# Altium schematic sheet M_Audio.SchDoc
size Letter
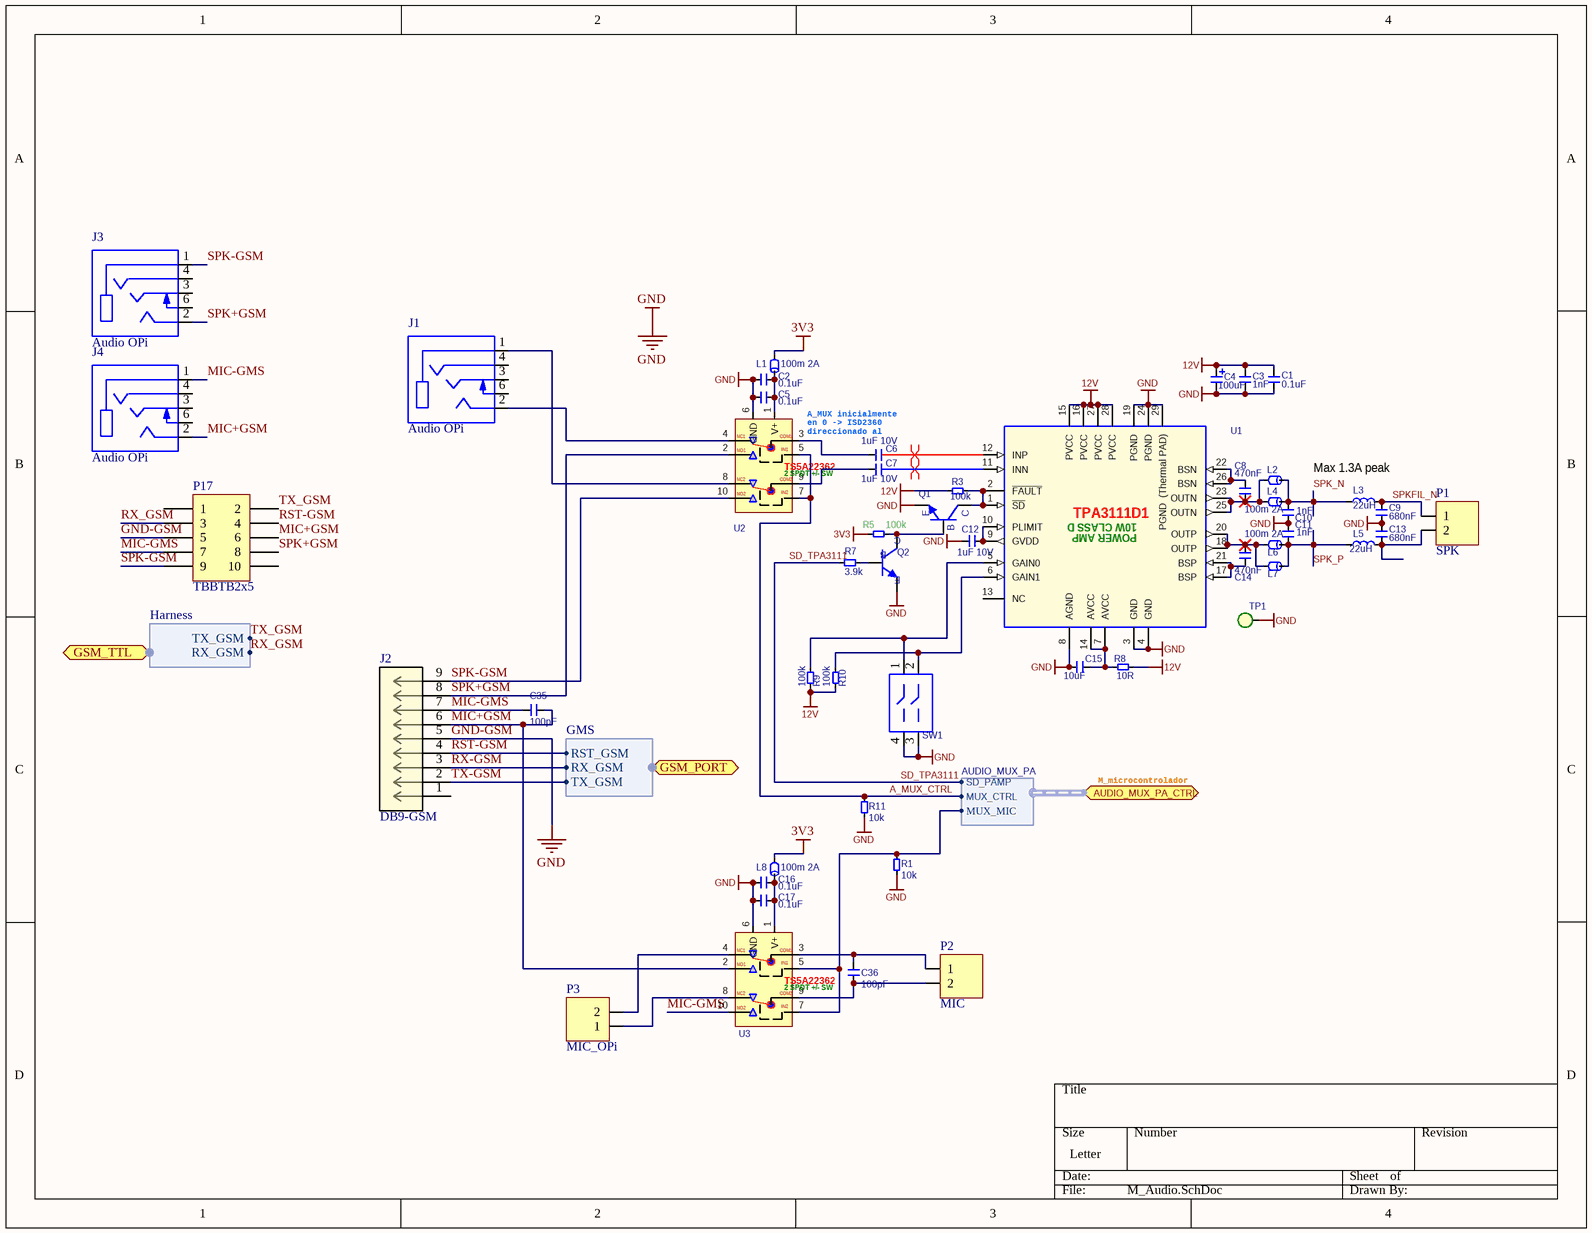
[diagram p0: M_Audio.SchDoc]

## Parts
C1  value 0.1uF  [PASS_CAPC0603 - REFLOW]  (hidden comment: PASS_CAP_EIL)
C2  value 0.1uF  [PASS_CAPC0603 - REFLOW]  (hidden comment: PASS_CAP_EIL)
C3  value 1nF  [PASS_CAPC0603 - REFLOW]  (hidden comment: PASS_CAP_EIL)
C4  value 100uF  [PASS_CAPPOL_SMD-F]  (hidden comment: PASS_CAPPOL_EIL)
C5  value 0.1uF  [PASS_CAPC0603 - REFLOW]  (hidden comment: PASS_CAP_EIL)
C6  value 1uF 10V  [PASS_CAPC0603 - REFLOW]  (hidden comment: PASS_CAP_EIL)
C7  value 1uF 10V  [PASS_CAPC0603 - REFLOW]  (hidden comment: PASS_CAP_EIL)
C8  value 470nF  [PASS_CAPC0603 - REFLOW]  (hidden comment: PASS_CAP_EIL)
C9  value 680nF  [PASS_CAPC1206 - REFLOW]  (hidden comment: PASS_CAP_EIL)
C10  value 1nF  [PASS_CAPC0603 - REFLOW]  (hidden comment: PASS_CAP_EIL)
C11  value 1nF  [PASS_CAPC0603 - REFLOW]  (hidden comment: PASS_CAP_EIL)
C12  value 1uF 10V  [PASS_CAPC0603 - REFLOW]  (hidden comment: PASS_CAP_EIL)
C13  value 680nF  [PASS_CAPC1206 - REFLOW]  (hidden comment: PASS_CAP_EIL)
C14  value 470nF  [PASS_CAPC0603 - REFLOW]  (hidden comment: PASS_CAP_EIL)
C15  value 10uF  [PASS_CAPC0805 - REFLOW]  (hidden comment: PASS_CAP_EIL)
C16  value 0.1uF  [PASS_CAPC0603 - REFLOW]  (hidden comment: PASS_CAP_EIL)
C17  value 0.1uF  [PASS_CAPC0603 - REFLOW]  (hidden comment: PASS_CAP_EIL)
C35  value 100pF  [PASS_CAPC0603 - REFLOW]  (hidden comment: PASS_CAP_EIL)
C36  value 100pF  [PASS_CAPC0603 - REFLOW]  (hidden comment: PASS_CAP_EIL)
J1  Audio OPi  [CUI_SJ-43515RS-SMT]
J2  DB9-GSM  [CONN_5747844-6]
J3  Audio OPi  [CUI_SJ-43515RS-SMT]
J4  Audio OPi  [CUI_SJ-43515RS-SMT]
L1  value 100m 2A  [PASS_FER0805 - REFLOW]  (hidden comment: PASS_FERRITEBEAD_EIL)
L2  PASS_FERRITEBEAD_EIL  [PASS_FER1812 - REFLOW]  (value not drawn)
L3  value 22uH  [PASS_INDUCT_BOURNS_SRU1063]  (hidden comment: PASS_L_EIL)
L4  value 100m 2A  [PASS_FER0805 - REFLOW]  (hidden comment: PASS_FERRITEBEAD_EIL)
L5  value 22uH  [PASS_INDUCT_BOURNS_SRU1063]  (hidden comment: PASS_L_EIL)
L6  value 100m 2A  [PASS_FER0805 - REFLOW]  (hidden comment: PASS_FERRITEBEAD_EIL)
L7  PASS_FERRITEBEAD_EIL  [PASS_FER1812 - REFLOW]  (value not drawn)
L8  value 100m 2A  [PASS_FER0805 - REFLOW]  (hidden comment: PASS_FERRITEBEAD_EIL)
P1  SPK  [TBHDR2P3.5VERTICAL]
P2  MIC  [TBHDR2P3.5VERTICAL]
P3  MIC_OPi  [TBHDR2P3.5VERTICAL]
P17  TBBTB2x5  [TBBTB2x5]
Q1  TRAN_BJT_NPN_EIL  [3PIN_SOT-23 BJT - REFLOW]  (value not drawn)
Q2  TRAN_BJT_NPN_EIL  [3PIN_SOT-23 BJT - REFLOW]  (value not drawn)
R1  value 10k  [PASS_RESC0805 - REFLOW]  (hidden comment: PASS_R_EIL)
R3  value 100k  [PASS_RESC0603 - REFLOW]  (hidden comment: PASS_R_EIL)
R5  value 100k  [PASS_RESC0603 - REFLOW]  (hidden comment: PASS_R_EIL)
R7  value 3.9k  [PASS_RESC0603 - REFLOW]  (hidden comment: PASS_R_EIL)
R8  value 10R  [PASS_RESC0603 - REFLOW]  (hidden comment: PASS_R_EIL)
R9  value 100k  [PASS_RESC0603 - REFLOW]  (hidden comment: PASS_R_EIL)
R10  value 100k  [PASS_RESC0603 - REFLOW]  (hidden comment: PASS_R_EIL)
R11  value 10k  [PASS_RESC0805 - REFLOW]  (hidden comment: PASS_R_EIL)
SW1  SW_DIP2_EIL  [SWIT_DIP-2- RAISED THR]  (value not drawn)
TP1  TEST POINT_EIL  [MISC_TESTPOINT THR]  (value not drawn)
U1  AUDIO AMP_TPA3111D1_28-TSSOP-EP_EIL  [CHIP_TSSOP-28 EXPOSED PAD LARGO 9.7MM/ANCHO 4.4MM/PITCH 0.65MM - REFLOW]  (value not drawn)
U2  MUXA_TS5A22362DGSR_10-MSOP_EIL  [CHIP_MSOP-10 LARGO 3.0MM/ANCHO 3.0MM/PITCH 0.5MM - REFLOW]  (value not drawn)
U3  MUXA_TS5A22362DGSR_10-MSOP_EIL  [CHIP_MSOP-10 LARGO 3.0MM/ANCHO 3.0MM/PITCH 0.5MM - REFLOW]  (value not drawn)

## Ports
AUDIO_MUX_PA_CTRL (harness AUDIO_MUX_PA), GSM_PORT (harness GMS), GSM_TTL (harness Harness)

## Harnesses
AUDIO_MUX_PA: SD_PAMP, MUX_CTRL, MUX_MIC
GMS: RST_GSM, RX_GSM, TX_GSM
Harness: RX_GSM, TX_GSM

## Nets
3V3: L1.1 L8.1 R5.2
12V: C1.1 C3.2 C4.1 R3.2 R8.1 R9.2 R10.2 U1.15(PVCC) U1.16(PVCC) U1.27(PVCC) U1.28(PVCC)
GND-GSM: C1.2 C2.2 C3.1 C4.2 C5.2 C9.1 C10.1 C11.2 C12.2 C13.2 C15.1 C16.2 C17.2 J2.5 P17.5 Q1.E Q2.E R1.2 R11.2 SW1.3 SW1.4 TP1.1 U1.3(GND) U1.4(GND) U1.8(AGND) U1.19(PGND) U1.24(PGND) U1.29(PGND__(Thermal_PAD)) U2.6(GND) U3.6(GND)  [also labelled GND]
A_MUX_CTRL: R11.1 U2.5(IN1) U2.7(IN2) ; port AUDIO_MUX_PA_CTRL.MUX_CTRL
MIC+GSM: C35.2 J2.6 J4.2(TIP) P17.6 U3.2(NO1)
MIC-GMS: C35.1 J2.7 J4.1(SLEEVE) P17.7 U3.10(NO2)
RST-GSM: J2.4 P17.4 ; port GSM_PORT.RST_GSM
RX-GSM: J2.3 ; port GSM_PORT.RX_GSM
RX_GSM: P17.3 ; port GSM_TTL.RX_GSM
SD_TPA3111: R7.1 ; port AUDIO_MUX_PA_CTRL.SD_PAMP
SPK+GSM: J2.8 J3.2(TIP) P17.8 U2.2(NO1)
SPK-GSM: J2.9 J3.1(SLEEVE) P17.9 U2.10(NO2)
SPK_N: C10.2 L2.2 L3.1 L4.2
SPK_P: C11.1 L5.1 L6.2 L7.2
SPKFIL_N: C9.2 L3.2 P1.1
TX-GSM: J2.2 ; port GSM_PORT.TX_GSM
TX_GSM: P17.2 ; port GSM_TTL.TX_GSM
NetC2_1: C2.1 C5.1 L1.2 U2.1(V+)
NetC6_1: C6.1 U2.3(COM1)
NetC6_2: C6.2 U1.12(INP)
NetC7_1: C7.1 U2.9(COM2)
NetC7_2: C7.2 U1.11(INN)
NetC8_1: C8.1 U1.22(BSN) U1.26(BSN)
NetC8_2: C8.2 L2.1 L4.1 U1.23(OUTN) U1.25(OUTN)
NetC12_1: C12.1 U1.9(GVDD) U1.10(PLIMIT)
NetC13_1: C13.1 L5.2 P1.2
NetC14_1: C14.1 L6.1 L7.1 U1.18(OUTP) U1.20(OUTP)
NetC14_2: C14.2 U1.17(BSP) U1.21(BSP)
NetC15_2: C15.2 R8.2 U1.7(AVCC) U1.14(AVCC)
NetC16_1: C16.1 C17.1 L8.2 U3.1(V+)
NetC36_1: C36.1 P2.2 U3.9(COM2)
NetC36_2: C36.2 P2.1 U3.3(COM1)
NetJ1_1: J1.1(SLEEVE) U2.8(NC2)
NetJ1_2: J1.2(TIP) U2.4(NC1)
NetP3_1: P3.1 U3.8(NC2)
NetP3_2: P3.2 U3.4(NC1)
NetQ1_B: Q1.B Q2.C R5.1
NetQ1_C: Q1.C R3.1 U1.1(~{SD}) U1.2(~{FAULT})
NetQ2_B: Q2.B R7.2
NetR1_1: R1.1 U3.5(IN1) U3.7(IN2) ; port AUDIO_MUX_PA_CTRL.MUX_MIC
NetR9_1: R9.1 SW1.1 U1.5(GAIN0)
NetR10_1: R10.1 SW1.2 U1.6(GAIN1)

Not connected (* = marked no-connect by the designer): J1 3(RING1) 4(RING2) 6(RING_SWITCH); J2 1; J3 3(RING1) 4(RING2) 6(RING_SWITCH); J4 3(RING1) 4(RING2) 6(RING_SWITCH); P17 1 10; U1 13(NC)

## Layout directives
differential pair: NetC6_2, NetC7_2

## Notes on the sheet
- A_MUX inicialmente en 0 -> ISD2360 direccionado al principio
- Max 1.3A peak
- M_microcontrolador
- (in symbol AUDIO AMP_TPA3111D1_28-TSSOP-EP_EIL) TPA3111D1; 10W CLASS D; POWER AMP
- (in symbol MUXA_TS5A22362DGSR_10-MSOP_EIL) 2 SPDT +/- SW

## Library data of the parts
C1 C2 C5 C16 C17 = PASS_CAP_EIL: CAP CER 0.1UF 25V X7R 0603; PartNo: CL10B104KA8NNNC; Manufacturer Name: Samsung Electro-Mechanics; PartDescription: CAP CER 0.1UF 50V Y5V 0603; Type: Surface Mount; Package: 0603 (1608 Metric); Digi-Key Part Number: 1276-1012-1-ND; Distributors Part Number: 1276-1012-1-ND; Manufacturers Part Number: CL10B104KA8NNNC
C3 C10 C11 = PASS_CAP_EIL: CAP CER 1000PF 50V X7R 0603; PartNo: 06035C102KAT2A; Manufacturer Name: AVX Corporation; PartDescription: CAP CER 1000PF 50V C0G/NP0 0603; Type: Surface Mount; Package: 0603 (1608 Metric); Digi-Key Part Number: 478-5005-1-ND; Distributors Part Number: 478-5005-1-ND; Manufacturers Part Number: 06035C102KAT2A
C4 = PASS_CAPPOL_EIL: CAP ALUM 100UF 20% 35V SMD; PartNo: EEE-FP1V101AP; Manufacturer Name: Panasonic Electronic Components; Type: Surface Mount; Package: Radial, Can - SMD; Digi-Key Part Number: PCE4442CT-ND; Distributors Part Number: PCE4442CT-ND; Manufacturers Part Number: EEE-FP1V101AP; PartDescription: CAP ALUM 100UF 20% 35V SMD
C6 C7 C12 = PASS_CAP_EIL: CAP CER 1UF 10V X7R 0603; PartNo: LMK107B7105KA-T; Manufacturer Name: AVX Corporation; Type: Surface Mount; Package: 0603 (1608 Metric); Digi-Key Part Number: 478-7940-1-ND; Distributors Part Number: 478-7940-1-ND; Manufacturers Part Number: LMK107B7105KA-T; PartDescription: AVX Corporation
C8 C14 = PASS_CAP_EIL: CAP CER 0.47UF 16V X7R 0603; PartNo: C1608X7R1C474K080AC; Manufacturer Name: Murata Electronics North America; Type: Surface Mount; Package: 0603 (1608 Metric); Digi-Key Part Number: 490-4775-1-ND; Distributors Part Number: 490-4775-1-ND; Manufacturers Part Number: C1608X7R1C474K080AC; PartDescription: CAP CER 0.47UF 16V X7R 0603
C9 C13 = PASS_CAP_EIL: CAP CER 0.68UF 50V X7R 1206; PartNo: C3216X7R1H684K160AA; Manufacturer Name: TDK Corporation; Type: Surface Mount; Package: 1206 (3216 Metric); Digi-Key Part Number: 445-4013-1-ND; Distributors Part Number: 445-4013-1-ND; Manufacturers Part Number: C3216X7R1H684K160AA; PartDescription: CAP CER 0.68UF 50V X7R 1206
C15 = PASS_CAP_EIL: CAP CER 10UF 25V X5R 0805; PartNo: CC0805ZKY5V6BB106; Manufacturer Name: Yageo; PartDescription: CAP CER 10UF 10V Y5V 0805; Type: Surface Mount; Package: 0805; Digi-Key Part Number: 311-1355-1-ND; Distributors Part Number: 311-1355-1-ND; Manufacturers Part Number: CC0805ZKY5V6BB106
C35 C36 = PASS_CAP_EIL: CAP CER 0.1UF 25V X7R 0603; PartNo: CL10B101KB8NNNC; Manufacturer Name: Samsung Electro-Mechanics; PartDescription: CAP CER 100PF 50V X7R 0603; Type: Surface Mount; Package: 0603 (1608 Metric); Digi-Key Part Number: 1276-1909-1-ND; Distributors Part Number: 1276-1909-1-ND; Manufacturers Part Number: CL10B101KB8NNNC
J1 J3 J4 = SJ-43515RS-SMT: PartNo: SJ-43515RS-SMT-TR; Manufacturer Name: CUI Inc.; PartDescription: CONN JACK 4COND 3.5MM SMD R/A; Value: *; Digi-Key Part Number: CP-43515RSSJCT-ND; Distributors Part Number: CP-43515RSSJCT-ND; Manufacturers Part Number: SJ-43515RS-SMT-TR; Type: Surface Mount
J2 = 5747844-6: Imported; Manufacturer Name: TE Connectivity AMP Connectors; PartDescription: CONN D-SUB RCPT 9POS R/A SOLDER; Review: No instalar; Digi-Key Part Number: A32119-ND; PartNo: 5747844-6; Distributors Part Number: A32119-ND; Manufacturers Part Number: 5747844-6; Package: 9 Position D-Sub Receptacle; Type: Through Hole
L1 L4 L6 L8 = PASS_FERRITEBEAD_EIL: FERRITE BEAD 220 OHM 0805 1LN; PartNo: MH2029-221Y; Manufacturer Name: Bourns Inc.; Type: Surface Mount; Package: 0805 (2012 Metric); Digi-Key Part Number: MH2029-221YCT-ND; Distributors Part Number: MH2029-221YCT-ND; Manufacturers Part Number: MH2029-221Y; PartDescription: FERRITE BEAD 220 OHM 0805 1LN
L2 L7 = PASS_FERRITEBEAD_EIL: FERRITE BEAD 70 OHM 1812 1LN; PartNo: 742792510; Manufacturer Name: Wurth Electronics Inc.; Value: 70 Ohm@100MHz; Type: Surface Mount; Package: 1812 (4532 Metric); Digi-Key Part Number: 732-1640-1-ND; Distributors Part Number: 732-1640-1-ND; Manufacturers Part Number: 742792510; PartDescription: FERRITE BEAD 70 OHM 1812 1LN
L3 L5 = PASS_L_EIL: FIXED IND 22UH 3A 60 MOHM SMD; PartNo: SRU1063-220Y; Manufacturer Name: Bourns Inc.; Type: Surface Mount; Package: 0.394" L x 0.394" W (10.00mm x 10.00mm); Digi-Key Part Number: SRU1063-220YCT-ND; Distributors Part Number: SRU1063-220YCT-ND; Manufacturers Part Number: SRU1063-220Y; PartDescription: FIXED IND 22UH 3A 60 MOHM SMD
P1 P3 = TBHDR2P3.5: Connector 2 positions with pitch 3.5mm; PartNo: 691321100002; Manufacturer Name: Wurth Electronics Inc.; PartDescription: TERM BLOCK HDR 2POS VERT 3.5MM; Digi-Key Part Number: 732-2763-ND; Package: 0.138" (3.50mm) Vertical Through Hole; Distributors Part Number: 732-2763-ND; Manufacturers Part Number: 691321100002; Type: Through Hole; Value: 2 Position
P2 = TBHDR2P3.5: Connector 2 positions with pitch 3.5mm; PartNo: 691321100002; PartDescription: TERM BLOCK HDR 2POS VERT 3.5MM; Manufacturer Name: Wurth Electronics Inc.; Digi-Key Part Number: 732-2763-ND; Package: 0.138" (3.50mm) Vertical Through Hole; Type: Through Hole; Manufacturers Part Number: 691321100002; Distributors Part Number: 732-2763-ND; Value: 2 Position
P17 = TBBTB2x5: Connector board to board 2 Rows, 5 Columns Pitch 2.54mm; Manufacturer Name: On Shore Technology Inc.; Manufacturers Part Number: 302-S101; PartDescription: CONN HEADER VERT 10POS 2.54MM; Digi-Key Part Number: ED1543-ND; Distributors Part Number: ED1543-ND; PartNo: 302-S101; Type: Through Hole
Q1 Q2 = TRAN_BJT_NPN_EIL: TRANS NPN 45V 0.5A SOT23; PartNo: BC817-40LT1G; Manufacturer Name: ON Semiconductor; Type: Surface Mount; Package: TO-236-3, SC-59, SOT-23-3; Digi-Key Part Number: BC817-40LT1GOSCT-ND; Distributors Part Number: BC817-40LT1GOSCT-ND; Manufacturers Part Number: BC817-40LT1G; PartDescription: TRANS NPN 45V 0.5A SOT23
R1 R11 = PASS_R_EIL: RES SMD 10K OHM 1% 1/10W 0603; PartNo: RC0805FR-0710KL; Manufacturer Name: Yageo; PartDescription: RES SMD 10K OHM 1% 1/8W 0805; Package: 0805 (2012 Metric); Digi-Key Part Number: 311-10.0KCRCT-ND; Distributors Part Number: 311-10.0KCRCT-ND; Manufacturers Part Number: RC0805FR-0710KL; Type: Surface Mount
R3 R5 R9 R10 = PASS_R_EIL: RES SMD 100K OHM 1% 1/10W 0603; PartNo: RC0603FR-07100KL; Manufacturer Name: Yageo; PartDescription: RES SMD 100K OHM 1% 1/8W 0805; Package: 0603 (1608 Metric); Digi-Key Part Number: YAG3359CT-ND; Distributors Part Number: YAG3359CT-ND; Manufacturers Part Number: RC0603FR-07100KL; Type: Surface Mount
R7 = PASS_R_EIL: RES SMD 3.9K OHM 1% 1/10W 0603; PartNo: RC0603FR-073K9L; Manufacturer Name: Yageo; Package: 0603 (1608 Metric); Digi-Key Part Number: 311-3.90KHRCT-ND; Distributors Part Number: 311-3.90KHRCT-ND; Manufacturers Part Number: RC0603FR-073K9L; PartDescription: RES SMD 3.9K OHM 1% 1/10W 0603; Type: Surface Mount
R8 = PASS_R_EIL: RES SMD 10 OHM 1% 1/10W 0603; PartNo: RC0603FR-0710RL; Manufacturer Name: Stackpole Electronics Inc; PartDescription: RES 10 OHM 1% 1/4W 0805; Package: 0603 (1608 Metric); Digi-Key Part Number: RNCP0805FTD10R0CT-ND; Distributors Part Number: RNCP0805FTD10R0CT-ND; Manufacturers Part Number: RC0603FR-0710RL; Type: Surface Mount
SW1 = SW_DIP2_EIL: SWITCH TIN CONT 2 SEC 50V; PartNo: 208-2; Manufacturer Name: CTS Electrocomponents; PartDescription: SWITCH SLIDE DIP SPST 50MA 24V; Value: DIP SWITCH 2; Digi-Key Part Number: CT2082-ND; Distributors Part Number: CT2082-ND; Manufacturers Part Number: 208-2; Package: 0.100" (2.54mm), Full; Type: Through Hole
TP1 = TEST POINT_EIL: TESTPOINT; PartNo: NO; Value: NO; Package: NO; Manufacturers Part Number: NO
U1 = AUDIO AMP_TPA3111D1_28-TSSOP-EP_EIL: IC AMP AUD PWR 10W MONO 28HTSSOP_AMPLIFICADOR CLASE D 10W 28-HTSSOP EXPOSED PAD; PartNo: TPA3111D1PWPR; Manufacturer Name: Texas Instruments; Package: 28-PowerTSSOP (0.173", 4.40mm Width); Value: TPA3111; Digi-Key Part Number: 296-25121-1-ND; Distributors Part Number: 296-25121-1-ND; Manufacturers Part Number: TPA3111D1PWPR; PartDescription: IC AMP AUD PWR 10W MONO 28HTSSOP; Type: Surface Mount
U2 U3 = MUXA_TS5A22362DGSR_10-MSOP_EIL: IC SWITCH DUAL SPDT 10MSOP_5-V/3.3-V 2-CHANNEL 2:1 MULTIPLEXER/DEMULTIPLEXER ANALOGICO +/- VIN 10-MSOP; Manufacturer Name: Texas Instruments; Package: 10-TFSOP, 10-MSOP (0.118", 3.00mm Width); PartNo: TS5A22362DGSR; Value: TS5A22362; Digi-Key Part Number: 296-24799-1-ND; Distributors Part Number: 296-24799-1-ND; Manufacturers Part Number: TS5A22362DGSR; PartDescription: IC SWITCH DUAL SPDT 10MSOP; Type: Surface Mount